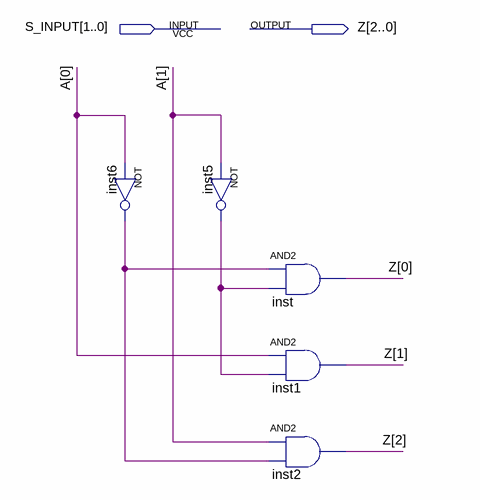
[diagram p0: schematic sheet]
// Quartus schematic OUTPUT_LOGIC.bdf as structural Verilog: 5 symbols, 2 pins
module OUTPUT_LOGIC (
  input  [1:0] S_INPUT,
  output [2:0] Z
);

  wire inst5_out, inst6_out;
  wire [1:0] A;

  not inst6 (inst6_out, A[0]);
  not inst5 (inst5_out, A[1]);
  and inst (Z[0], inst6_out, inst5_out);
  and inst1 (Z[1], A[0], inst5_out);
  and inst2 (Z[2], A[1], inst6_out);
endmodule
